# Altium schematic sheet PAGE16.SchDoc
size 246 x 182 mm
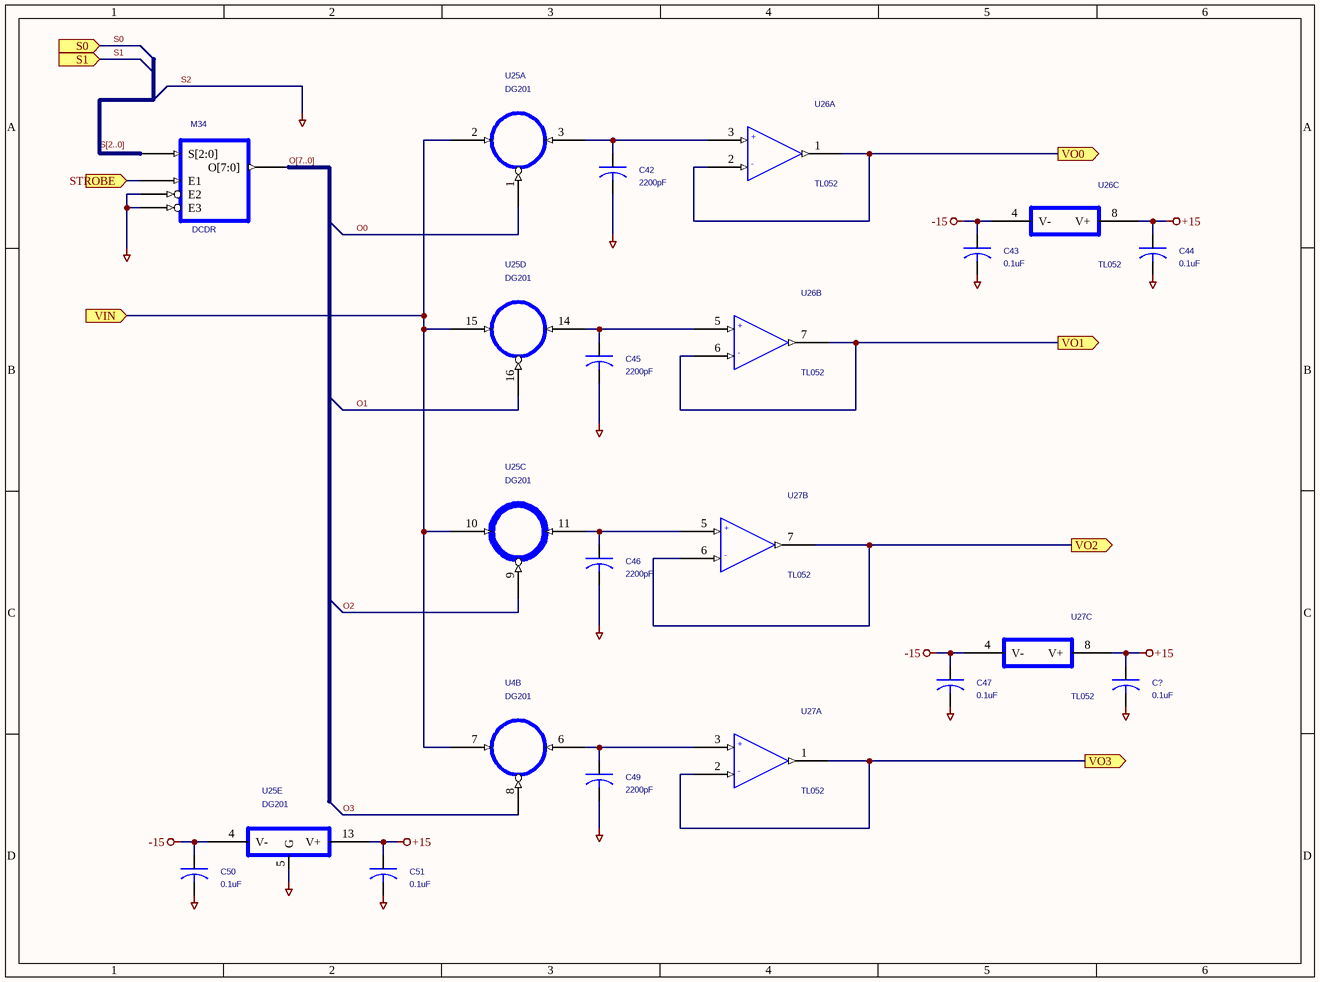
[diagram p0: PAGE16.SchDoc]

## Parts
C42  2200pF  [AXIAL0.5X0.2]
C43  0.1uF  [AXIALCAP0.3]
C44  0.1uF  [AXIALCAP0.3]
C45  2200pF  [AXIAL0.5X0.2]
C46  2200pF  [AXIAL0.5X0.2]
C47  0.1uF  [AXIALCAP0.3]
C49  2200pF  [AXIAL0.5X0.2]
C50  0.1uF  [AXIALCAP0.3]
C51  0.1uF  [AXIALCAP0.3]
C?  0.1uF  [AXIALCAP0.3]
M34  DCDR
U4  DG201  [DIP16]  (part B of 5)
U25  DG201  [DIP16]  (parts A,C,D,E of 5)
U26  TL052  [DIP8]  (parts A,B,C of 3)
U27  TL052  [DIP8]  (parts A,B,C of 3)

## Ports
S0 (in), S1 (in), STROBE (in), VIN (in), VO0 (out), VO1 (out), VO2 (out), VO3 (out)

## Nets
+15: C44.1 C51.1 C?.1 U25.13(V+) U26.8(V+) U27.8(V+)
-15: C43.1 C47.1 C50.1 U25.4(V-) U26.4(V-) U27.4(V-)
S2: C42.2 C43.2 C44.2 C45.2 C46.2 C47.2 C49.2 C50.2 C51.2 C?.2 M34.E2 M34.E3 U25.5(G)  [also labelled AGND]
O0: U25.1(IN)
O1: U25.16(IN)
O2: U25.9(IN)
O3: U4.8(IN)
S0: port S0
S1: port S1
STROBE: M34.E1 ; port STROBE
VIN: U4.7(D) U25.2(D) U25.10(D) U25.15(D) ; port VIN
VO0: U26.1(OUT) U26.2(-) ; port VO0
VO1: U26.6(-) U26.7(OUT) ; port VO1
VO2: U27.6(-) U27.7(OUT) ; port VO2
VO3: U27.1(OUT) U27.2(-) ; port VO3
NetC42_1: C42.1 U25.3(S1) U26.3(+)
NetC45_1: C45.1 U25.14(S1) U26.5(+)
NetC46_1: C46.1 U25.11(S1) U27.5(+)
NetC49_1: C49.1 U4.6(S1) U27.3(+)

Not connected (* = marked no-connect by the designer): M34 O[7:0] S[2:0]

## Buses and harness runs
bus O[7..0]
bus S[2..0]

## Library data of the parts
C42 C45 C46 C49 = CAP
C43 C44 C47 C50 C51 C? = CAP_Dup1
U4 U25 = DG201H: PACKAGE: SH1; DIGIKEY PN: ADG201AKNZ-ND
U26 U27 = GEN DUAL OPAMP-H
  U26: PACKAGE: SH2
  U27: PACKAGE: BUFF2
M34 = DCDR: C__21_PartReference: =M34_C__21_PartReference; TitleBlock_1_Page_Number: =M34_TitleBlock_1_Page_Number; TitleBlock_1_Title: =M34_TitleBlock_1_Title